# Altium schematic sheet Core.SchDoc: F1C100S-Core
size A4
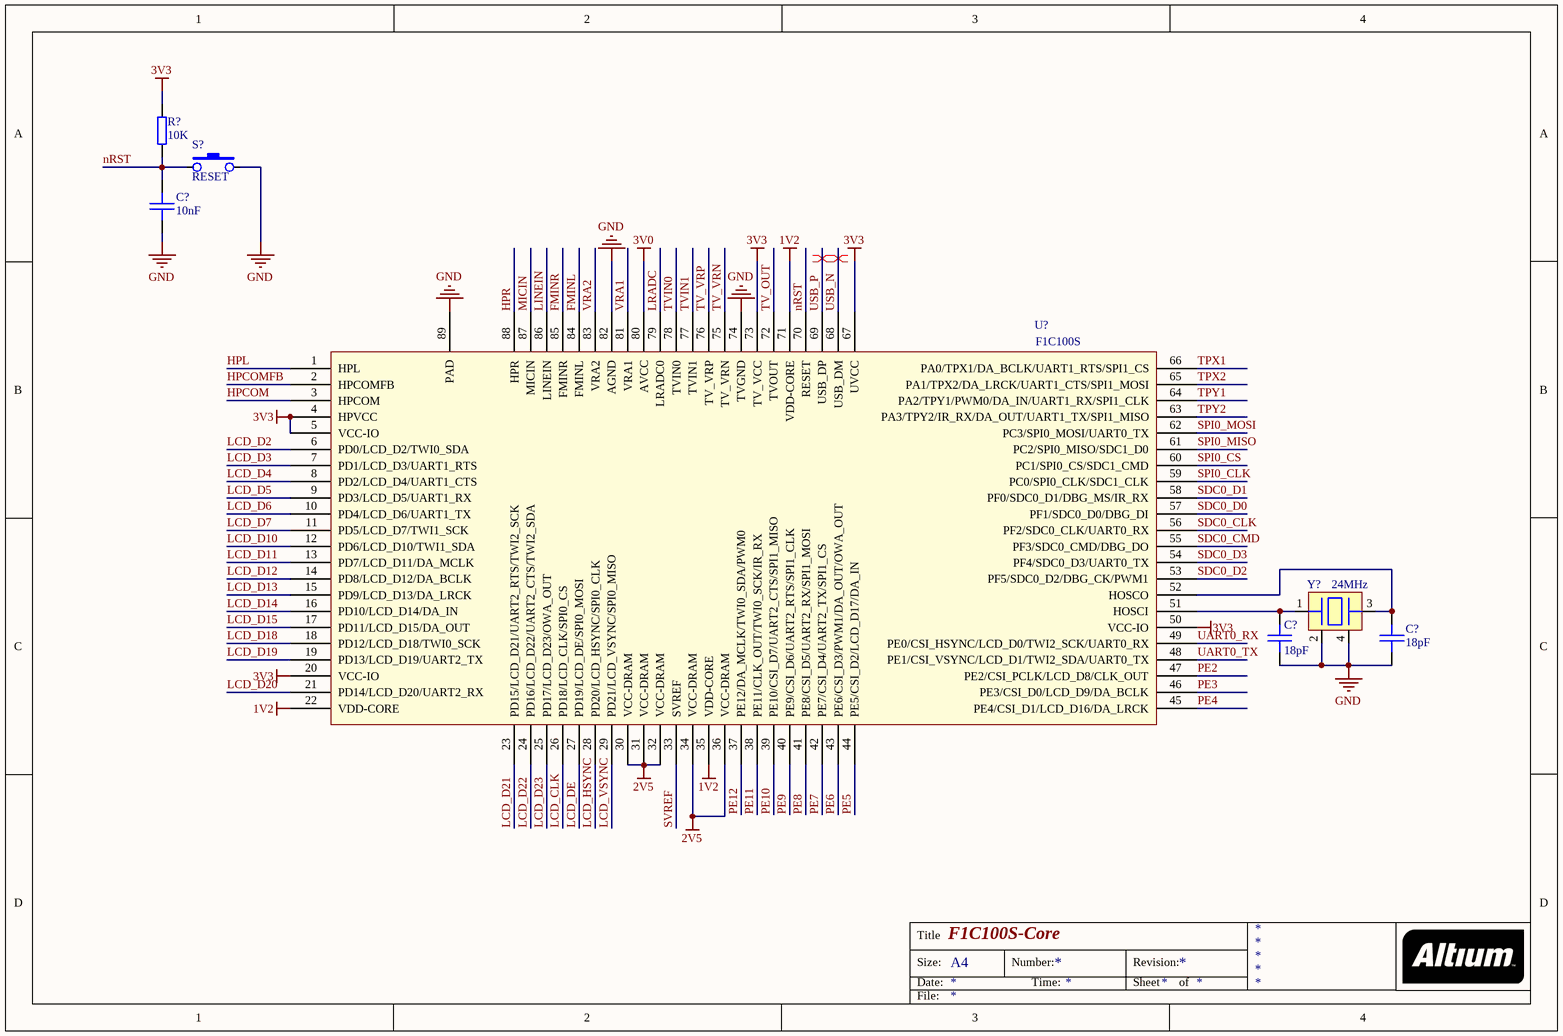
[diagram p0: Core.SchDoc]

## Parts
(Parts that share a designator on the sheet are numbered #1, #2 ... from top to bottom, then left to right.)
C?#1  10nF  [CAP-0603]
C?#2  18pF  [CAP-0603]
C?#3  18pF  [CAP-0603]
R?  10K  [RES-0603]
S?  RESET  [KEY_3X4X2]
U?  F1C100S  [QFN88-0.4]
Y?  24MHz  [LC-SMD-3225_4P]

## Nets
1V2: U?.22(VDD-CORE) U?.35(VDD-CORE) U?.71(VDD-CORE)
2V5: U?.30(VCC-DRAM) U?.31(VCC-DRAM) U?.32(VCC-DRAM) U?.34(VCC-DRAM) U?.36(VCC-DRAM)
3V0: U?.80(AVCC)
3V3: R?.2 U?.4(HPVCC) U?.5(VCC-IO) U?.20(VCC-IO) U?.50(VCC-IO) U?.67(UVCC) U?.73(TV_VCC)
GND: C?#1.2 C?#2.2 C?#3.2 S?.2 U?.74(TVGND) U?.82(AGND) U?.89(PAD) Y?.2 Y?.4
FMINL: U?.84(FMINL)
FMINR: U?.85(FMINR)
HPCOM: U?.3(HPCOM)
HPCOMFB: U?.2(HPCOMFB)
HPL: U?.1(HPL)
HPR: U?.88(HPR)
LCD_CLK: U?.26(PD18/LCD_CLK/SPI0_CS)
LCD_D2: U?.6(PD0/LCD_D2/TWI0_SDA)
LCD_D3: U?.7(PD1/LCD_D3/UART1_RTS)
LCD_D4: U?.8(PD2/LCD_D4/UART1_CTS)
LCD_D5: U?.9(PD3/LCD_D5/UART1_RX)
LCD_D6: U?.10(PD4/LCD_D6/UART1_TX)
LCD_D7: U?.11(PD5/LCD_D7/TWI1_SCK)
LCD_D10: U?.12(PD6/LCD_D10/TWI1_SDA)
LCD_D11: U?.13(PD7/LCD_D11/DA_MCLK)
LCD_D12: U?.14(PD8/LCD_D12/DA_BCLK)
LCD_D13: U?.15(PD9/LCD_D13/DA_LRCK)
LCD_D14: U?.16(PD10/LCD_D14/DA_IN)
LCD_D15: U?.17(PD11/LCD_D15/DA_OUT)
LCD_D18: U?.18(PD12/LCD_D18/TWI0_SCK)
LCD_D19: U?.19(PD13/LCD_D19/UART2_TX)
LCD_D20: U?.21(PD14/LCD_D20/UART2_RX)
LCD_D21: U?.23(PD15/LCD_D21/UART2_RTS/TWI2_SCK)
LCD_D22: U?.24(PD16/LCD_D22/UART2_CTS/TWI2_SDA)
LCD_D23: U?.25(PD17/LCD_D23/OWA_OUT)
LCD_DE: U?.27(PD19/LCD_DE/SPI0_MOSI)
LCD_HSYNC: U?.28(PD20/LCD_HSYNC/SPI0_CLK)
LCD_VSYNC: U?.29(PD21/LCD_VSYNC/SPI0_MISO)
LINEIN: U?.86(LINEIN)
LRADC: U?.79(LRADC0)
MICIN: U?.87(MICIN)
nRST: C?#1.1 R?.1 S?.1 U?.70(RESET)
PE2: U?.47(PE2/CSI_PCLK/LCD_D8/CLK_OUT)
PE3: U?.46(PE3/CSI_D0/LCD_D9/DA_BCLK)
PE4: U?.45(PE4/CSI_D1/LCD_D16/DA_LRCK)
PE5: U?.44(PE5/CSI_D2/LCD_D17/DA_IN)
PE6: U?.43(PE6/CSI_D3/PWM1/DA_OUT/OWA_OUT)
PE7: U?.42(PE7/CSI_D4/UART2_TX/SPI1_CS)
PE8: U?.41(PE8/CSI_D5/UART2_RX/SPI1_MOSI)
PE9: U?.40(PE9/CSI_D6/UART2_RTS/SPI1_CLK)
PE10: U?.39(PE10/CSI_D7/UART2_CTS/SPI1_MISO)
PE11: U?.38(PE11/CLK_OUT/TWI0_SCK/IR_RX)
PE12: U?.37(PE12/DA_MCLK/TWI0_SDA/PWM0)
SDC0_CLK: U?.56(PF2/SDC0_CLK/UART0_RX)
SDC0_CMD: U?.55(PF3/SDC0_CMD/DBG_DO)
SDC0_D0: U?.57(PF1/SDC0_D0/DBG_DI)
SDC0_D1: U?.58(PF0/SDC0_D1/DBG_MS/IR_RX)
SDC0_D2: U?.53(PF5/SDC0_D2/DBG_CK/PWM1)
SDC0_D3: U?.54(PF4/SDC0_D3/UART0_TX)
SPI0_CLK: U?.59(PC0/SPI0_CLK/SDC1_CLK)
SPI0_CS: U?.60(PC1/SPI0_CS/SDC1_CMD)
SPI0_MISO: U?.61(PC2/SPI0_MISO/SDC1_D0)
SPI0_MOSI: U?.62(PC3/SPI0_MOSI/UART0_TX)
SVREF: U?.33(SVREF)
TPX1: U?.66(PA0/TPX1/DA_BCLK/UART1_RTS/SPI1_CS)
TPX2: U?.65(PA1/TPX2/DA_LRCK/UART1_CTS/SPI1_MOSI)
TPY1: U?.64(PA2/TPY1/PWM0/DA_IN/UART1_RX/SPI1_CLK)
TPY2: U?.63(PA3/TPY2/IR_RX/DA_OUT/UART1_TX/SPI1_MISO)
TV_OUT: U?.72(TVOUT)
TV_VRN: U?.75(TV_VRN)
TV_VRP: U?.76(TV_VRP)
TVIN0: U?.78(TVIN0)
TVIN1: U?.77(TVIN1)
UART0_RX: U?.49(PE0/CSI_HSYNC/LCD_D0/TWI2_SCK/UART0_RX)
UART0_TX: U?.48(PE1/CSI_VSYNC/LCD_D1/TWI2_SDA/UART0_TX)
USB_N: U?.68(USB_DM)
USB_P: U?.69(USB_DP)
VRA1: U?.81(VRA1)
VRA2: U?.83(VRA2)
NetC?#2_1: C?#2.1 U?.51(HOSCI) Y?.1
NetC?#3_1: C?#3.1 U?.52(HOSCO) Y?.3

## Layout directives
differential pair: USB_N, USB_P

## Notes on the sheet
- Title
- Size:
- Date:
- A4
- Number:
- Time:
- Revision:
- Sheet
- of
- File:

## Library data of the parts
C?#1-C?#3 = C_0603: 陶瓷贴片电容0603; tolerance: 10%; voltage: 50V; ESR: 1.73mOhm; IRMS: 5.59A; Series: X7R
  C?#1: C_value: 10nF
  C?#2 C?#3: C_value: 18pF
R? = R_0603: 贴片电阻0603; tolerance: 5%; voltage: 50V; power: 0.063W; R_value: 10K
S? = KEY: 轻触开关3X4X2
Y? = XTAL_PASSIVE: 贴片无源晶振(3225); X_value: 24MHz